# Altium schematic sheet 16.SchDoc
size 420 x 297 mm
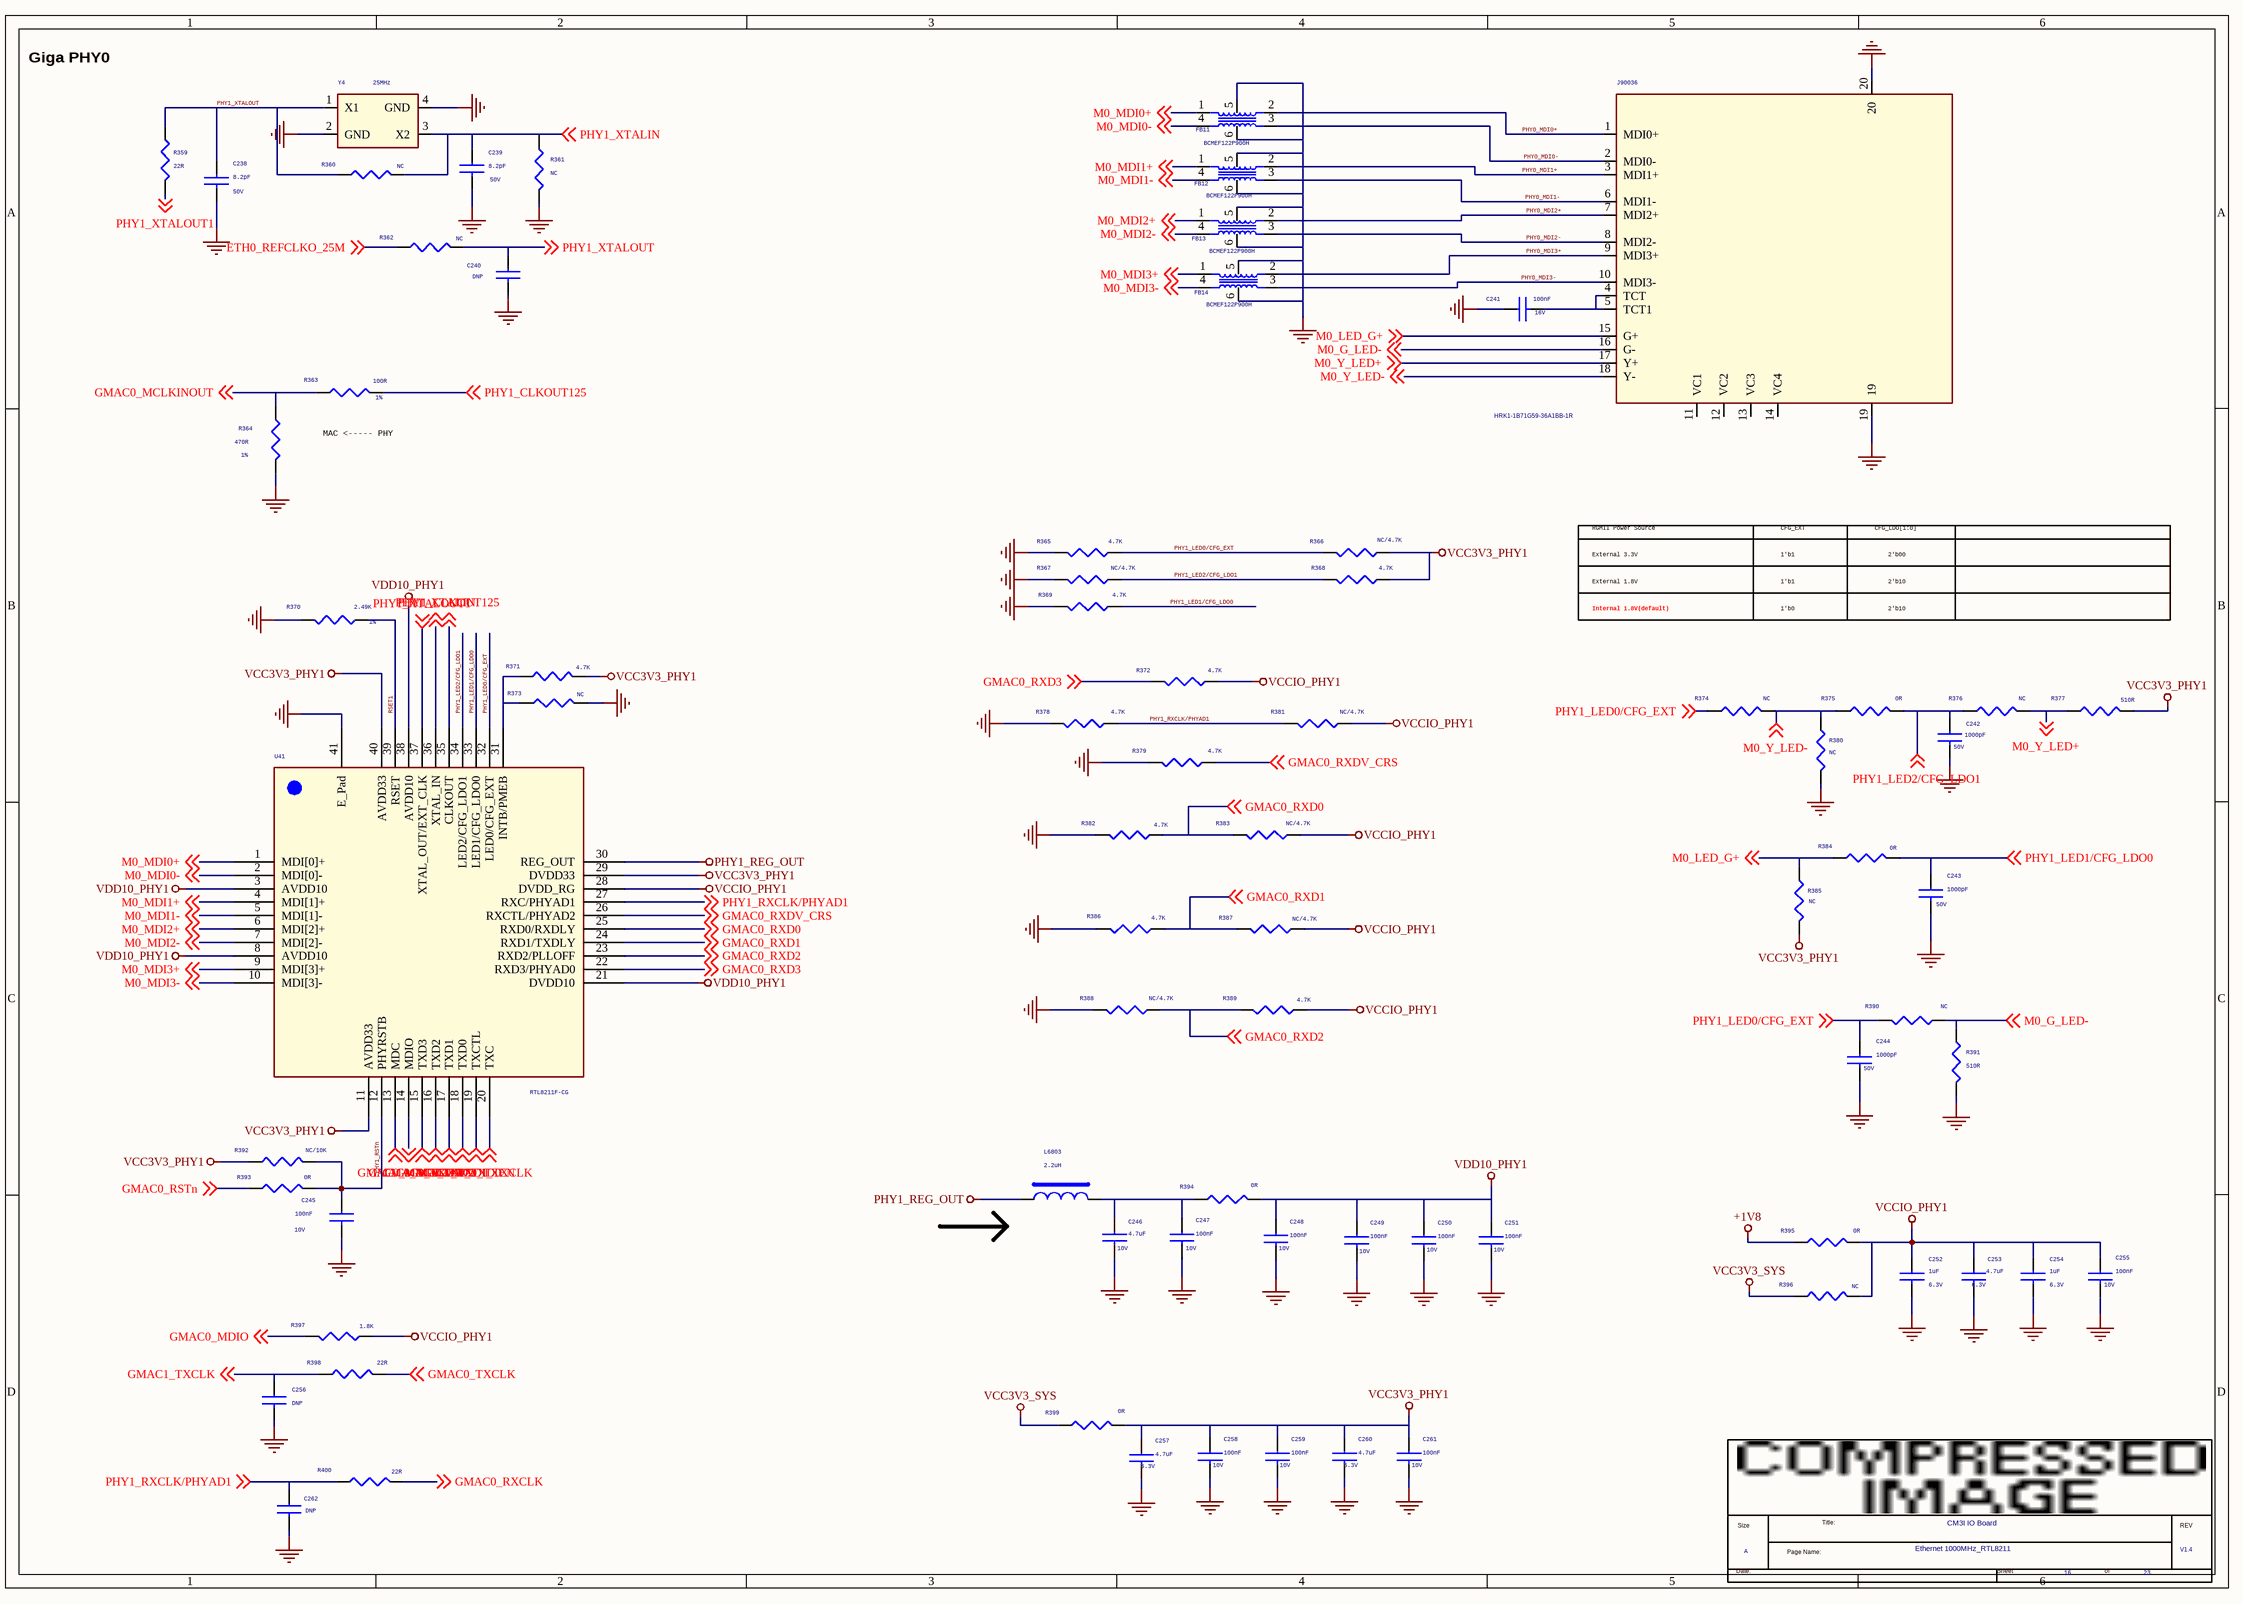
[diagram p0: 16.SchDoc]

## Parts
*  Page Count: 23  Page Number: 16  Page Size: A  Title: CM3I IO Board  RevCode: V1.4  Doc: Ethernet 1000MHz_RTL8211  (hidden comment: radxa_1010)  (graphical)
C238  8.2pF  Voltage: 50V  [C0402]
C239  8.2pF  Voltage: 50V  [C0402]
C240  DNP  [C0402]
C241  100nF  Voltage: 16V  [C0402]
C242  1000pF  Voltage: 50V  [C0402]
C243  1000pF  Voltage: 50V  [C0402]
C244  1000pF  Voltage: 50V  [C0402]
C245  100nF  Voltage: 10V  [C0402]
C246  4.7uF  Voltage: 10V  [C0603]
C247  100nF  Voltage: 10V  [C0402]
C248  100nF  Voltage: 10V  [C0402]
C249  100nF  Voltage: 10V  [C0402]
C250  100nF  Voltage: 10V  [C0402]
C251  100nF  Voltage: 10V  [C0402]
C252  1uF  Voltage: 6.3V  [C0402]
C253  4.7uF  Voltage: 6.3V  [C0402]
C254  1uF  Voltage: 6.3V  [C0402]
C255  100nF  Voltage: 10V  [C0402]
C256  DNP  [C0402]
C257  4.7uF  Voltage: 6.3V  [C0402]
C258  100nF  Voltage: 10V  [C0402]
C259  100nF  Voltage: 10V  [C0402]
C260  4.7uF  Voltage: 6.3V  [C0402]
C261  100nF  Voltage: 10V  [C0402]
C262  DNP  [C0402]
FB11  BCMEF122P900H  [GMDG-6PIN_ESD]
FB12  BCMEF122P900H  [GMDG-6PIN_ESD]
FB13  BCMEF122P900H  [GMDG-6PIN_ESD]
FB14  BCMEF122P900H  [GMDG-6PIN_ESD]
J90036  HRK1-1B71G59-36A1BB-1R  [RJ45_PULSE]
L6803  2.2uH  [IND_252010]
R359  22R  [R0402]
R360  NC  [R0402]
R361  NC  [R0402]
R362  NC  [R0402]
R363  100R  Tolerance: 1%  [R0402]
R364  470R  Tolerance: 1%  [R0402]
R365  4.7K  [R0402]
R366  NC/4.7K  [R0402]
R367  NC/4.7K  [R0402]
R368  4.7K  [R0402]
R369  4.7K  [R0402]
R370  2.49K  Tolerance: 1%  [R0402]
R371  4.7K  [R0402]
R372  4.7K  [R0402]
R373  NC  [R0402]
R374  NC  [R0402]
R375  0R  [R0402]
R376  NC  [R0402]
R377  510R  [R0402]
R378  4.7K  [R0402]
R379  4.7K  [R0402]
R380  NC  [R0402]
R381  NC/4.7K  [R0402]
R382  4.7K  [R0402]
R383  NC/4.7K  [R0402]
R384  0R  [R0402]
R385  NC  [R0402]
R386  4.7K  [R0402]
R387  NC/4.7K  [R0402]
R388  NC/4.7K  [R0402]
R389  4.7K  [R0402]
R390  NC  [R0402]
R391  510R  [R0402]
R392  NC/10K  [R0402]
R393  0R  [R0402]
R394  0R  [R0402]
R395  0R  [R0402]
R396  NC  [R0402]
R397  1.8K  [R0402]
R398  22R  [R0402]
R399  0R  [R0402]
R400  22R  [R0402]
U41  RTL8211F-CG  [QFN40_5R00X5R00X0R80_T]
Y4  25MHz  [CRY-3225]

## Nets
+1V8: R395.1
GND: C238.2 C239.2 C240.2 C241.1 C242.2 C243.2 C244.2 C245.2 C246.2 C247.2 C248.2 C249.2 C250.2 C251.2 C252.2 C253.2 C254.2 C255.2 C256.2 C257.2 C258.2 C259.2 C260.2 C261.2 C262.2 FB11.5 FB11.6 FB12.5 FB12.6 FB13.5 FB13.6 FB14.5 FB14.6 J90036.19 J90036.20 R361.2 R364.2 R365.2 R367.2 R369.2 R370.2 R373.2 R378.2 R379.2 R380.2 R382.2 R386.2 R388.2 R391.2 U41.41(E_Pad) Y4.2(GND) Y4.4(GND)
PHY1_REG_OUT: L6803.1 U41.30(REG_OUT)
VCC3V3_PHY1: C257.1 C258.1 C259.1 C260.1 C261.1 R366.1 R368.1 R371.2 R377.2 R385.2 R392.1 R399.2 U41.11(AVDD33) U41.29(DVDD33) U41.40(AVDD33)
VCC3V3_SYS: R396.1 R399.1
VCCIO_PHY1: C252.1 C253.1 C254.1 C255.1 R372.1 R381.1 R383.1 R387.1 R389.1 R395.2 R396.2 R397.1 U41.28(DVDD_RG)
VDD10_PHY1: C248.1 C249.1 C250.1 C251.1 R394.2 U41.3(AVDD10) U41.8(AVDD10) U41.21(DVDD10) U41.38(AVDD10)
ETH0_REFCLKO_25M: R362.1 ; off-sheet ETH0_REFCLKO_25M
GMAC0_MCLKINOUT: R363.1 R364.1 ; off-sheet GMAC0_MCLKINOUT
GMAC0_MDC: U41.13(MDC) ; off-sheet GMAC0_MDC
GMAC0_MDIO: R397.2 U41.14(MDIO) ; off-sheet GMAC0_MDIO
GMAC0_RSTn: R393.1 ; off-sheet GMAC0_RSTn
GMAC0_RXCLK: R400.2 ; off-sheet GMAC0_RXCLK
GMAC0_RXD0: R382.1 R383.2 U41.25(RXD0/RXDLY) ; off-sheet GMAC0_RXD0
GMAC0_RXD1: R386.1 R387.2 U41.24(RXD1/TXDLY) ; off-sheet GMAC0_RXD1
GMAC0_RXD2: R388.1 R389.2 U41.23(RXD2/PLLOFF) ; off-sheet GMAC0_RXD2
GMAC0_RXD3: R372.2 U41.22(RXD3/PHYAD0) ; off-sheet GMAC0_RXD3
GMAC0_RXDV_CRS: R379.1 U41.26(RXCTL/PHYAD2) ; off-sheet GMAC0_RXDV_CRS
GMAC0_TXCLK: R398.2 ; off-sheet GMAC0_TXCLK
GMAC0_TXD0: U41.18(TXD0) ; off-sheet GMAC0_TXD0
GMAC0_TXD1: U41.17(TXD1) ; off-sheet GMAC0_TXD1
GMAC0_TXD2: U41.16(TXD2) ; off-sheet GMAC0_TXD2
GMAC0_TXD3: U41.15(TXD3) ; off-sheet GMAC0_TXD3
GMAC0_TXEN: U41.19(TXCTL) ; off-sheet GMAC0_TXEN
GMAC1_TXCLK: C256.1 R398.1 U41.20(TXC) ; off-sheet GMAC1_TXCLK
M0_G_LED-: J90036.16(G-) R390.1 R391.1 ; off-sheet M0_G_LED-
M0_LED_G+: J90036.15(G+) R384.1 R385.1 ; off-sheet M0_LED_G+
M0_MDI0+: FB11.1(R1) U41.1(MDI[0]+) ; off-sheet M0_MDI0+
M0_MDI0-: FB11.4(R2) U41.2(MDI[0]-) ; off-sheet M0_MDI0-
M0_MDI1+: FB12.1(R1) U41.4(MDI[1]+) ; off-sheet M0_MDI1+
M0_MDI1-: FB12.4(R2) U41.5(MDI[1]-) ; off-sheet M0_MDI1-
M0_MDI2+: FB13.1(R1) U41.6(MDI[2]+) ; off-sheet M0_MDI2+
M0_MDI2-: FB13.4(R2) U41.7(MDI[2]-) ; off-sheet M0_MDI2-
M0_MDI3+: FB14.1(R1) U41.9(MDI[3]+) ; off-sheet M0_MDI3+
M0_MDI3-: FB14.4(R2) U41.10(MDI[3]-) ; off-sheet M0_MDI3-
M0_Y_LED+: J90036.17(Y+) R376.2 R377.1 ; off-sheet M0_Y_LED+
M0_Y_LED-: J90036.18(Y-) R374.1 R375.1 R380.1 ; off-sheet M0_Y_LED-
PHY0_MDI0+: FB11.2(R4) J90036.1(MDI0+)
PHY0_MDI0-: FB11.3(R3) J90036.2(MDI0-)
PHY0_MDI1+: FB12.2(R4) J90036.3(MDI1+)
PHY0_MDI1-: FB12.3(R3) J90036.6(MDI1-)
PHY0_MDI2+: FB13.2(R4) J90036.7(MDI2+)
PHY0_MDI2-: FB13.3(R3) J90036.8(MDI2-)
PHY0_MDI3+: FB14.2(R4) J90036.9(MDI3+)
PHY0_MDI3-: FB14.3(R3) J90036.10(MDI3-)
PHY1_CLKOUT125: R363.2 U41.35(CLKOUT) ; off-sheet PHY1_CLKOUT125
PHY1_LED0/CFG_EXT: C244.1 R365.1 R366.2 R374.2 R390.2 U41.32(LED0/CFG_EXT) ; off-sheet PHY1_LED0/CFG_EXT
PHY1_LED1/CFG_LDO0: C243.1 R369.1 R384.2 U41.33(LED1/CFG_LDO0) ; off-sheet PHY1_LED1/CFG_LDO0
PHY1_LED2/CFG_LDO1: C242.1 R367.1 R368.2 R375.2 R376.1 U41.34(LED2/CFG_LDO1) ; off-sheet PHY1_LED2/CFG_LDO1
PHY1_RSTn: C245.1 R392.2 R393.2 U41.12(PHYRSTB)
PHY1_RXCLK/PHYAD1: C262.1 R378.1 R381.2 R400.1 U41.27(RXC/PHYAD1) ; off-sheet PHY1_RXCLK/PHYAD1
PHY1_XTALIN: C239.1 R360.2 R361.1 U41.36(XTAL_IN) Y4.3(X2) ; off-sheet PHY1_XTALIN
PHY1_XTALOUT: C238.1 C240.1 R359.1 R360.1 R362.2 Y4.1(X1) ; off-sheet PHY1_XTALOUT
PHY1_XTALOUT1: R359.2 U41.37(XTAL_OUT/EXT_CLK) ; off-sheet PHY1_XTALOUT1
RSET1: R370.1 U41.39(RSET)
NetC241_2: C241.2 J90036.4(TCT) J90036.5(TCT1)
NetC246_1: C246.1 C247.1 L6803.2 R394.1
NetR371_1: R371.1 R373.1 U41.31(INTB/PMEB)

Not connected (* = marked no-connect by the designer): J90036 11(VC1) 12(VC2) 13(VC3) 14(VC4)

## Notes on the sheet
- Giga PHY0
- MAC <----- PHY
- RGMII Power Source
- CFG_EXT
- CFG_LDO[1:0]
- External 3.3V
- External 1.8V
- 1'b1
- 2'b00
- 2'b10
- Internal 1.8V(default)
- 1'b0
- (in symbol radxa_1010) Size; Title:; REV; Page Name:; Date:; Sheet; of

## Library data of the parts
C238 C239 = CAP NP_0_Dup4: cap,18.00pF,+/-5%,50V,C0G,C0402; Manufacturer PN: C1005C0G1H180J050BA; Manufacturer: TDK; Tolerance: 5%; Priority: A; Dielectric: C0G; Created by: JJJ; Part Type: C0402; RK PN: C1005C0G1H180J050BA
C240 C256 = CAP NP_0_Dup4: Did Not Place.; Number: 37; RK PN: DNPC0402; Priority: A; C_Voltage: 6.3V; Part Type: DNP; Manufacturer PN: DNPC0402; Created by: JJJ
C241 = CAP NP_0_Dup4: cap,100.00nF,+/-10%,16V,X5R,C0402; Manufacturer: TDK; RK PN: C1005X5R1C104K050BA; Priority: A; Tolerance: 10%; Dielectric: X5R; Part Type: C0402; Manufacturer PN: C1005X5R1C104K050BA; Created by: JJJ
C242-C244 = CAP NP_0_Dup4: cap,100.00pF,+/-10%,50V,C0G,C0402; Manufacturer: TDK; Number: 37; RK PN: C1005C0G1H101K050BA; Priority: A; Tolerance: 10%; C_Voltage: 6.3V; option: DNP; Dielectric: C0G; Part Type: C0402; Manufacturer PN: C1005C0G1H101K050BA; Created by: JJJ
C245 = CAP NP_0_Dup4: cap,100.00nF,+/-10%,10V,X5R,C0402; Manufacturer PN: C1005X5R1A104K050BA; Manufacturer: TDK; Tolerance: 10%; Priority: A; Dielectric: X5R; Created by: JJJ; Part Type: C0402; RK PN: C1005X5R1A104K050BA
C246 = CAP NP_0_Dup4: cap,4.70uF,+/-10%,10V,X5R,C0603; Manufacturer: TDK; RK PN: C1608X5R1A475K080AC; Priority: A; C_Voltage: 6.3V; Tolerance: 10%; Dielectric: X5R; Part Type: C0603; Manufacturer PN: C1608X5R1A475K080AC; Created by: JJJ
C247 C249-C251 C255 C258 C259 C261 = CAP NP_0_Dup4: cap,100.00nF,+/-10%,10V,X5R,C0402; Manufacturer PN: C1005X5R1A104K050BA; Manufacturer: TDK; C_Voltage: 6.3V; Tolerance: 10%; Priority: A; Number: 37; Dielectric: X5R; Created by: JJJ; Part Type: C0402; RK PN: C1005X5R1A104K050BA
C248 = CAP NP_0_Dup4: cap,100.00nF,+/-10%,10V,X5R,C0402; Manufacturer: TDK; Number: 37; RK PN: C1005X5R1A104K050BA; Priority: A; Tolerance: 10%; C_Voltage: 6.3V; Dielectric: X5R; Part Type: C0402; Manufacturer PN: C1005X5R1A104K050BA; Created by: JJJ
C252 C254 = CAP NP_0_Dup4: cap,1.00uF,+/-10%,6.3V,X5R,C0402; Manufacturer PN: C1005X5R0J105K050BB; Manufacturer: TDK; Tolerance: 10%; Priority: A; Dielectric: X5R; Created by: JJJ; C_Voltage: 6.3V; Part Type: C0402; RK PN: C1005X5R0J105K050BB
C253 C257 = CAP NP_0_Dup4: cap,4.70uF,+/-10%,6.3V,X5R,C0402; Manufacturer PN: C1005X5R0J475K050BC; Manufacturer: TDK; Tolerance: 10%; Priority: A; Dielectric: X5R; Created by: JJJ; C_Voltage: 6.3V; Part Type: C0402; RK PN: C1005X5R0J475K050BC
C260 = CAP NP_0_Dup4: cap,4.70uF,+/-10%,6.3V,X5R,C0402; Manufacturer: TDK; RK PN: C1005X5R0J475K050BC; Priority: A; Tolerance: 10%; Dielectric: X5R; Part Type: C0402; C_Voltage: 6.3V; Manufacturer PN: C1005X5R0J475K050BC; Created by: JJJ
C262 = CAP NP_0_Dup4: Did Not Place.; Manufacturer PN: DNPC0402; C_Voltage: 6.3V; Priority: A; Number: 37; Created by: JJJ; Part Type: DNP; RK PN: DNPC0402
FB11-FB14 = R-PACK4_0_Dup1
J90036 = HR911130C_1: 千兆网口接口，内置变压器; VAL: J00-0061; DESIG: 10/100 base TX LXT971A; BOI: RJ45; FAB: PULSE; DEV: CON_PULSE_J00-61; Priority: A; REF: J00-0061; RK PN: HR911130C; Part Type: Ethernet Jack; Manufacturer Part Number: HR911130C; Created by: JJJ
L6803 = INDUCTORS OF FERRITE_Dup1: Power Inductor,2.2uH,0.3,IND_303015; Manufacturer: sunlord; DC Resistor: 0.06ohm; Isat: 1.6A; RK PN: SWPA3015S2R2NT; Priority: A; Tolerance: 30%; Resonace frequency: 86M; Part Type: POWER_IND; Irms: 1.6A; Manufacturer PN: SWPA3015S2R2NT; Created by: YTL
R359 R361 = RESISTOR_0_Dup5: 通用厚膜电阻,0R,+/-5%,R0402,1/16W.; Manufacturer PN: RC0402JR-070RL; Manufacturer: YAGEO; Tolerance: 5%; option: DNP; Wattage: 1/16W; Priority: A; Created by: YTL; Part Type: 通用厚膜电阻; RK PN: RC0402JR-070RL
R360 = RESISTOR_0_Dup5: 通用厚膜电阻,0R,+/-5%,R0402,1/16W.; Manufacturer PN: RC0402JR-070RL; Manufacturer: YAGEO; Tolerance: 5%; Wattage: 1/16W; Priority: A; Option: DNP; Created by: YTL; Part Type: 通用厚膜电阻; RK PN: RC0402JR-070RL
R362 = RESISTOR_0_Dup5: 通用厚膜电阻,0R,+/-5%,R0402,1/16W.; Manufacturer: YAGEO; Tolerance: 5%; Option: DNP; RK PN: RC0402JR-070RL; Priority: A; Wattage: 1/16W; Part Type: 通用厚膜电阻; Manufacturer PN: RC0402JR-070RL; Created by: YTL
R363 = RESISTOR_0_Dup5: 通用厚膜电阻,100R,+/-5%,R0402,1/16W.; Manufacturer: YAGEO; RK PN: RC0402JR-07100RL; Priority: A; Wattage: 1/16W; Part Type: 通用厚膜电阻; Manufacturer PN: RC0402JR-07100RL; Created by: YTL
R364 = RESISTOR_0_Dup5: 通用厚膜电阻,120R,+/-5%,R0402,1/16W.; Manufacturer PN: RC0402JR-07120RL; Manufacturer: YAGEO; Wattage: 1/16W; Priority: A; Created by: YTL; Part Type: 通用厚膜电阻; RK PN: RC0402JR-07120RL
R365 R379 = RESISTOR_0_Dup5: 通用厚膜电阻,4K7,+/-5%,R0402,1/16W.; Manufacturer PN: RC0402JR-074K7L; Manufacturer: YAGEO; Tolerance: 5%; Wattage: 1/16W; Priority: A; Created by: YTL; Part Type: 通用厚膜电阻; RK PN: RC0402JR-074K7L
R366 = RESISTOR_0_Dup5: 通用厚膜电阻,4K7,+/-5%,R0402,1/16W.; Manufacturer PN: RC0402JR-074K7L; Manufacturer: YAGEO; Tolerance: 5%; Wattage: 1/16W; Priority: A; option: DNP; Created by: YTL; Part Type: 通用厚膜电阻; RK PN: RC0402JR-074K7L
R367 R381 R387 R388 = RESISTOR_0_Dup5: 通用厚膜电阻,4K7,+/-5%,R0402,1/16W.; Manufacturer: YAGEO; Tolerance: 5%; RK PN: RC0402JR-074K7L; Priority: A; Wattage: 1/16W; option: DNP; Part Type: 通用厚膜电阻; Manufacturer PN: RC0402JR-074K7L; Created by: YTL
R368 R369 R372 R378 R382 R386 R389 = RESISTOR_0_Dup5: 通用厚膜电阻,4K7,+/-5%,R0402,1/16W.; Manufacturer: YAGEO; Tolerance: 5%; RK PN: RC0402JR-074K7L; Priority: A; Wattage: 1/16W; Part Type: 通用厚膜电阻; Manufacturer PN: RC0402JR-074K7L; Created by: YTL
R370 = RESISTOR_0_Dup5: 通用厚膜电阻,2K49,+/-1%,R0402,1/16W.; Manufacturer PN: RC0402FR-072K49L; Manufacturer: YAGEO; Wattage: 1/16W; Priority: A; Created by: YTL; Part Type: 通用厚膜电阻; RK PN: RC0402FR-072K49L
R371 R374 R380 R393 = RESISTOR_0_Dup5: 通用厚膜电阻,0R,+/-5%,R0402,1/16W.; Manufacturer: YAGEO; Tolerance: 5%; RK PN: RC0402JR-070RL; Priority: A; Wattage: 1/16W; Part Type: 通用厚膜电阻; Manufacturer PN: RC0402JR-070RL; Created by: YTL
R373 R375 R399 = RESISTOR_0_Dup5: 通用厚膜电阻,0R,+/-5%,R0402,1/16W.; Manufacturer PN: RC0402JR-070RL; Manufacturer: YAGEO; Tolerance: 5%; Wattage: 1/16W; Priority: A; Created by: YTL; Part Type: 通用厚膜电阻; RK PN: RC0402JR-070RL
R376 = RESISTOR_0_Dup5: 通用厚膜电阻,0R,+/-5%,R0402,1/16W.; Manufacturer: YAGEO; Tolerance: 5%; RK PN: RC0402JR-070RL; Priority: A; Wattage: 1/16W; option: DNP; Part Type: 通用厚膜电阻; Manufacturer PN: RC0402JR-070RL; Created by: YTL
R377 R390 R391 = RESISTOR_0_Dup5: 通用厚膜电阻,510R,+/-5%,R0402,1/16W.; Manufacturer: YAGEO; Tolerance: 5%; RK PN: RC0402JR-07510RL; Priority: A; Wattage: 1/16W; Part Type: 通用厚膜电阻; Manufacturer PN: RC0402JR-07510RL; Created by: YTL
R383 = RESISTOR_0_Dup5: 通用厚膜电阻,4K7,+/-5%,R0402,1/16W.; Manufacturer PN: RC0402JR-074K7L; Manufacturer: YAGEO; Tolerance: 5%; option: DNP; Wattage: 1/16W; Priority: A; Created by: YTL; Part Type: 通用厚膜电阻; RK PN: RC0402JR-074K7L
R384 = RESISTOR_0_Dup5: 通用厚膜电阻,120R,+/-5%,R0402,1/16W.; Manufacturer PN: RC0402JR-07120RL; Manufacturer: YAGEO; Tolerance: 5%; Wattage: 1/16W; Priority: A; Created by: YTL; Part Type: 通用厚膜电阻; RK PN: RC0402JR-07120RL
R385 = RESISTOR_0_Dup5: 通用厚膜电阻,510R,+/-5%,R0402,1/16W.; Manufacturer PN: RC0402JR-07510RL; Manufacturer: YAGEO; Tolerance: 5%; Wattage: 1/16W; Priority: A; Created by: YTL; Part Type: 通用厚膜电阻; RK PN: RC0402JR-07510RL
R392 = RESISTOR_0_Dup5: 通用厚膜电阻,10K,+/-5%,R0402,1/16W.; Manufacturer: YAGEO; Tolerance: 5%; RK PN: RC0402JR-0710KL; Priority: A; Wattage: 1/16W; Option: DNP; Part Type: 通用厚膜电阻; Manufacturer PN: RC0402JR-0710KL; Created by: YTL
R394 = RESISTOR_0_Dup5: 通用厚膜电阻,0R,+/-5%,R0402,1/16W.; Manufacturer PN: RC0402JR-070RL; Manufacturer: YAGEO; Tolerance: 5%; Wattage: 1/16W; Priority: A; option: DNP; Created by: YTL; Part Type: 通用厚膜电阻; RK PN: RC0402JR-070RL
R395 R396 = RESISTOR_0_Dup5: 通用厚膜电阻,0R,+/-5%,R0402,1/16W.; Manufacturer: YAGEO; Tolerance: 5%; option: DNP; RK PN: RC0402JR-070RL; Priority: A; Wattage: 1/16W; Part Type: 通用厚膜电阻; Manufacturer PN: RC0402JR-070RL; Created by: YTL
R397 = RESISTOR_0_Dup5: 通用厚膜电阻,1K8,+/-5%,R0402,1/16W.; Manufacturer PN: RC0402JR-071K8L; Manufacturer: YAGEO; Tolerance: 5%; Wattage: 1/16W; Priority: A; Created by: YTL; Part Type: 通用厚膜电阻; RK PN: RC0402JR-071K8L
R398 R400 = RESISTOR_0_Dup5: 通用厚膜电阻,22R,+/-5%,R0402,1/16W.; Manufacturer: YAGEO; Tolerance: 5%; RK PN: RC0402JR-0722RL; Priority: A; Wattage: 1/16W; Part Type: 通用厚膜电阻; Manufacturer PN: RC0402JR-0722RL; Created by: YTL
U41 = Ethernet_RTL8211F: Integrated 10/100/1000 Gigabit Ethernet Transceiver，Supports IEEE 802.3az-2010,; Manufacturer: RealTek(瑞昱); Priority: A; Created by: JJJ; Manufacturer PN: RTL8211F-CG; Part Type: Ethernet; RK PN: RTL8211F-CG
Y4 = CRYSTAL_4P: 无源晶振，25M，3225,±10ppm，10pF，Hosonic; Manufacturer PN: E3SB25.0000F10E11; Manufacturer: Hosonic(鸿星电子); Priority: A; Created by: JJJ; Part Type: CRYSTAL; RK PN: E3SB25.0000F10E11
* = radxa_1010: Page Create Date: March  8, 1995